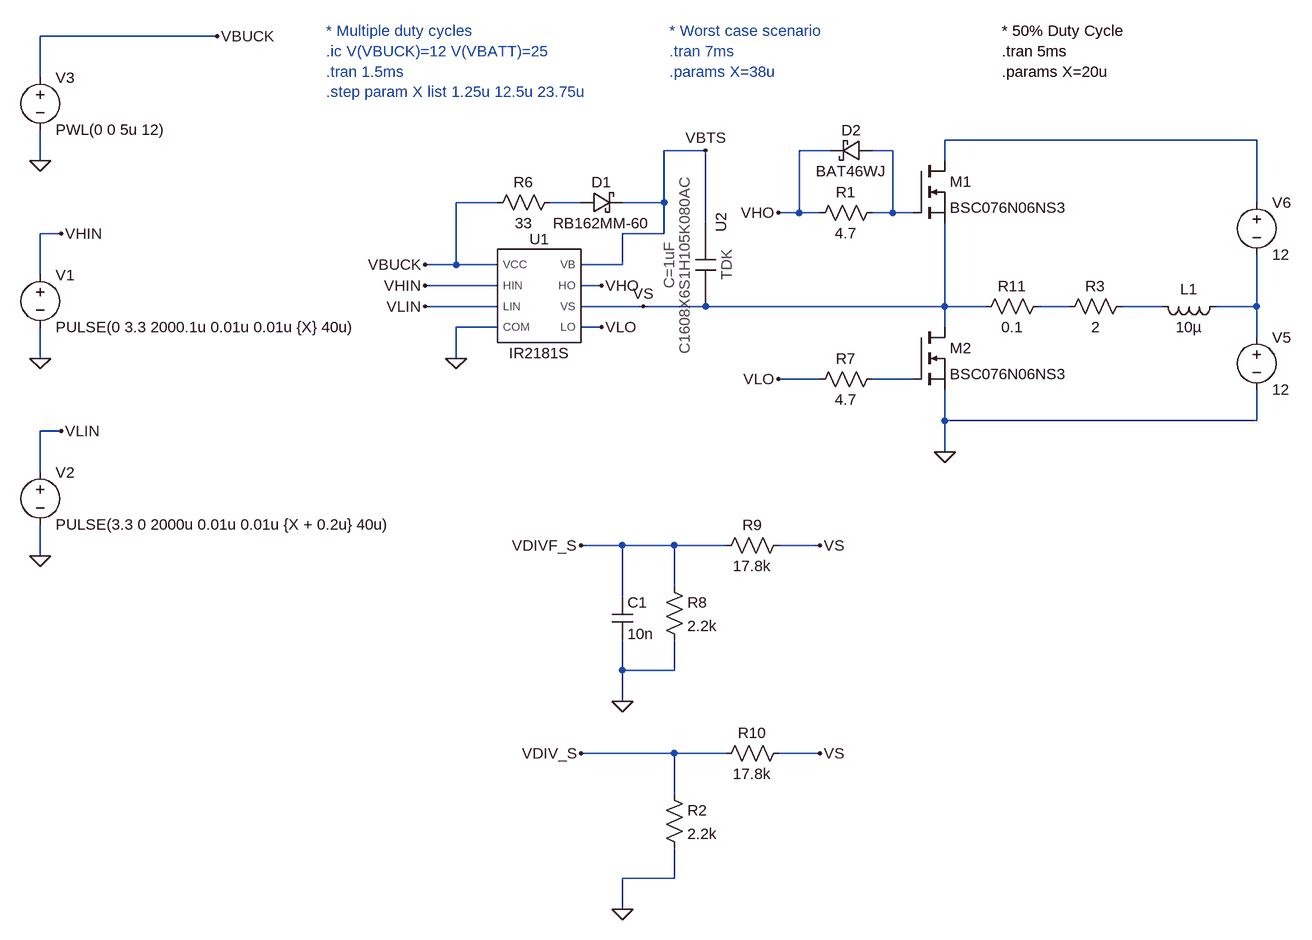
[diagram p0: schematic half-bridge-driver.asc]
half-bridge-driver.asc, the LTspice schematic file:
Version 4
SHEET 1 1976 1216
WIRE -16 -144 -288 -144
WIRE -288 -80 -288 -144
WIRE 1584 16 1104 16
WIRE 736 32 672 32
WIRE 928 32 880 32
WIRE 1024 32 992 32
WIRE -288 48 -288 0
WIRE 1104 48 1104 16
WIRE 416 112 352 112
WIRE 544 112 496 112
WIRE 672 112 672 32
WIRE 672 112 608 112
WIRE 1584 112 1584 16
WIRE 880 128 880 32
WIRE 880 128 848 128
WIRE 912 128 880 128
WIRE 1024 128 1024 32
WIRE 1024 128 992 128
WIRE 1056 128 1024 128
WIRE 736 144 736 32
WIRE -256 160 -288 160
WIRE 672 160 672 112
WIRE 672 160 608 160
WIRE 352 208 352 112
WIRE 352 208 304 208
WIRE 416 208 352 208
WIRE 608 208 608 160
WIRE 608 208 544 208
WIRE -288 224 -288 160
WIRE 416 240 304 240
WIRE 576 240 544 240
WIRE 416 272 304 272
WIRE 640 272 544 272
WIRE 736 272 640 272
WIRE 1104 272 1104 144
WIRE 1104 272 736 272
WIRE 1168 272 1104 272
WIRE 1296 272 1248 272
WIRE 1440 272 1376 272
WIRE 1584 272 1584 192
WIRE 1584 272 1520 272
WIRE 416 304 352 304
WIRE 576 304 544 304
WIRE 1104 304 1104 272
WIRE 1584 320 1584 272
WIRE -288 352 -288 304
WIRE 352 352 352 304
WIRE 912 384 848 384
WIRE 1056 384 992 384
WIRE 1104 448 1104 400
WIRE 1584 448 1584 400
WIRE 1584 448 1104 448
WIRE -256 464 -288 464
WIRE 1104 496 1104 448
WIRE -288 528 -288 464
WIRE 608 640 544 640
WIRE 688 640 608 640
WIRE 768 640 688 640
WIRE 912 640 848 640
WIRE -288 656 -288 608
WIRE 688 704 688 640
WIRE 608 720 608 640
WIRE 608 832 608 784
WIRE 688 832 688 784
WIRE 688 832 608 832
WIRE 608 880 608 832
WIRE 688 960 544 960
WIRE 768 960 688 960
WIRE 912 960 848 960
WIRE 688 1024 688 960
WIRE 688 1152 688 1104
WIRE 688 1152 608 1152
WIRE 608 1200 608 1152
FLAG -288 352 0
FLAG -288 656 0
FLAG -288 48 0
FLAG -16 -144 VBUCK
FLAG -256 464 VLIN
FLAG -256 160 VHIN
FLAG 304 240 VHIN
FLAG 304 272 VLIN
FLAG 304 208 VBUCK
FLAG 352 352 0
FLAG 576 240 VHO
FLAG 576 304 VLO
FLAG 848 128 VHO
FLAG 848 384 VLO
FLAG 736 32 VBTS
FLAG 640 272 VS
FLAG 1104 496 0
FLAG 608 880 0
FLAG 912 640 VS
FLAG 544 640 VDIVF_S
FLAG 608 1200 0
FLAG 912 960 VS
FLAG 544 960 VDIV_S
SYMBOL voltage -288 208 R0
SYMATTR InstName V1
SYMATTR Value PULSE(0 3.3 2000.1u 0.01u 0.01u {X} 40u)
SYMBOL voltage -288 512 R0
SYMATTR InstName V2
SYMATTR Value PULSE(3.3 0 2000u 0.01u 0.01u {X + 0.2u} 40u)
SYMATTR SpiceLine Rser=0
SYMBOL voltage -288 -96 R0
SYMATTR InstName V3
SYMATTR Value PWL(0 0 5u 12)
SYMATTR SpiceLine Rser=0
SYMBOL schottky 544 128 R270
WINDOW 0 32 32 VTop 2
WINDOW 3 0 32 VBottom 2
SYMATTR InstName D1
SYMATTR Value RB162MM-60
SYMATTR Description Diode
SYMATTR Type diode
SYMBOL Res 1008 112 R90
WINDOW 0 0 56 VBottom 2
WINDOW 3 32 56 VTop 2
SYMATTR InstName R1
SYMATTR Value 4.7
SYMBOL nmos 1056 48 R0
SYMATTR InstName M1
SYMATTR Value BSC076N06NS3
SYMBOL nmos 1056 304 R0
SYMATTR InstName M2
SYMATTR Value BSC076N06NS3
SYMBOL voltage 1584 304 R0
SYMATTR InstName V5
SYMATTR Value 12
SYMATTR SpiceLine Rser=0
SYMBOL voltage 1584 96 R0
SYMATTR InstName V6
SYMATTR Value 12
SYMATTR SpiceLine Rser=0
SYMBOL Res 1392 256 R90
WINDOW 0 0 56 VBottom 2
WINDOW 3 32 56 VTop 2
SYMATTR InstName R3
SYMATTR Value 2
SYMBOL ind 1536 256 R90
WINDOW 0 5 56 VBottom 2
WINDOW 3 32 56 VTop 2
SYMATTR InstName L1
SYMATTR Value 10µ
SYMBOL Res 512 96 R90
WINDOW 0 0 56 VBottom 2
WINDOW 3 32 56 VTop 2
SYMATTR InstName R6
SYMATTR Value 33
SYMBOL C1608X6S1H105K080AC_b 736 208 R90
SYMATTR InstName U2
SYMBOL Res 1008 368 R90
WINDOW 0 0 56 VBottom 2
WINDOW 3 32 56 VTop 2
SYMATTR InstName R7
SYMATTR Value 4.7
SYMBOL Res 672 688 R0
SYMATTR InstName R8
SYMATTR Value 2.2k
SYMBOL Res 864 624 R90
WINDOW 0 0 56 VBottom 2
WINDOW 3 32 56 VTop 2
SYMATTR InstName R9
SYMATTR Value 17.8k
SYMBOL cap 592 720 R0
SYMATTR InstName C1
SYMATTR Value 10n
SYMBOL Res 672 1008 R0
SYMATTR InstName R2
SYMATTR Value 2.2k
SYMBOL Res 864 944 R90
WINDOW 0 0 56 VBottom 2
WINDOW 3 32 56 VTop 2
SYMATTR InstName R10
SYMATTR Value 17.8k
SYMBOL Res 1264 256 R90
WINDOW 0 0 56 VBottom 2
WINDOW 3 32 56 VTop 2
SYMATTR InstName R11
SYMATTR Value 0.1
SYMBOL schottky 992 16 R90
WINDOW 0 0 32 VBottom 2
WINDOW 3 32 32 VTop 2
SYMATTR InstName D2
SYMATTR Value BAT46WJ
SYMBOL IR2181S 480 256 R0
SYMATTR InstName U1
TEXT 152 -152 Left 2 ;* Multiple duty cycles\n.ic V(VBUCK)=12 V(VBATT)=25\n.tran 1.5ms\n.step param X list 1.25u 12.5u 23.75u
TEXT 680 -152 Left 2 ;* Worst case scenario\n.tran 7ms\n.params X=38u
TEXT 1192 -152 Left 2 !* 50% Duty Cycle\n.tran 5ms\n.params X=20u

The netlist it stands for:
* half-bridge-driver.asc
V1 VHIN 0 PULSE(0 3.3 2000.1u 0.01u 0.01u {X} 40u)
V2 VLIN 0 PULSE(3.3 0 2000u 0.01u 0.01u {X + 0.2u} 40u) Rser=0
V3 VBUCK 0 PWL(0 0 5u 12) Rser=0
D1 N003 VBTS RB162MM-60
R1 N002 VHO 4.7
M1 N001 N002 VS VS BSC076N06NS3
M2 VS N007 0 0 BSC076N06NS3
V5 N006 0 12 Rser=0
V6 N001 N006 12 Rser=0
R3 N005 N004 2
L1 N006 N005 10µ
R6 N003 VBUCK 33
XU2 VBTS VS C1608X6S1H105K080AC_b  ; pins 1 2
R7 N007 VLO 4.7
R8 VDIVF_S 0 2.2k
R9 VS VDIVF_S 17.8k
C1 VDIVF_S 0 10n
R2 VDIV_S 0 2.2k
R10 VS VDIV_S 17.8k
R11 N004 VS 0.1
D2 N002 VHO BAT46WJ
XU1 VLO VHO 0 VLIN VHIN VBUCK VBTS VS IR2181S  ; pins LO HO COM LIN HIN VCC VB VS
.model D D
.lib standard.dio
.model NMOS NMOS
.model PMOS PMOS
.lib standard.mos
* * Multiple duty cycles
* .ic V(VBUCK)=12 V(VBATT)=25
* .tran 1.5ms
* .step param X list 1.25u 12.5u 23.75u
* * Worst case scenario
* .tran 7ms
* .params X=38u
* 50% Duty Cycle
.tran 5ms
.params X=20u
.lib C1608X6S1H105K080AC_b_LTspice.mod
.lib /Users/samvangysegem/Downloads/Infineon-IR2181S-PSpice-SimulationModels-v01_00-EN/Model/IR2181S.lib
.backanno
.end